# Altium schematic sheet Power.SchDoc
size A4; SheetNumber: 2; SheetTotal: 8
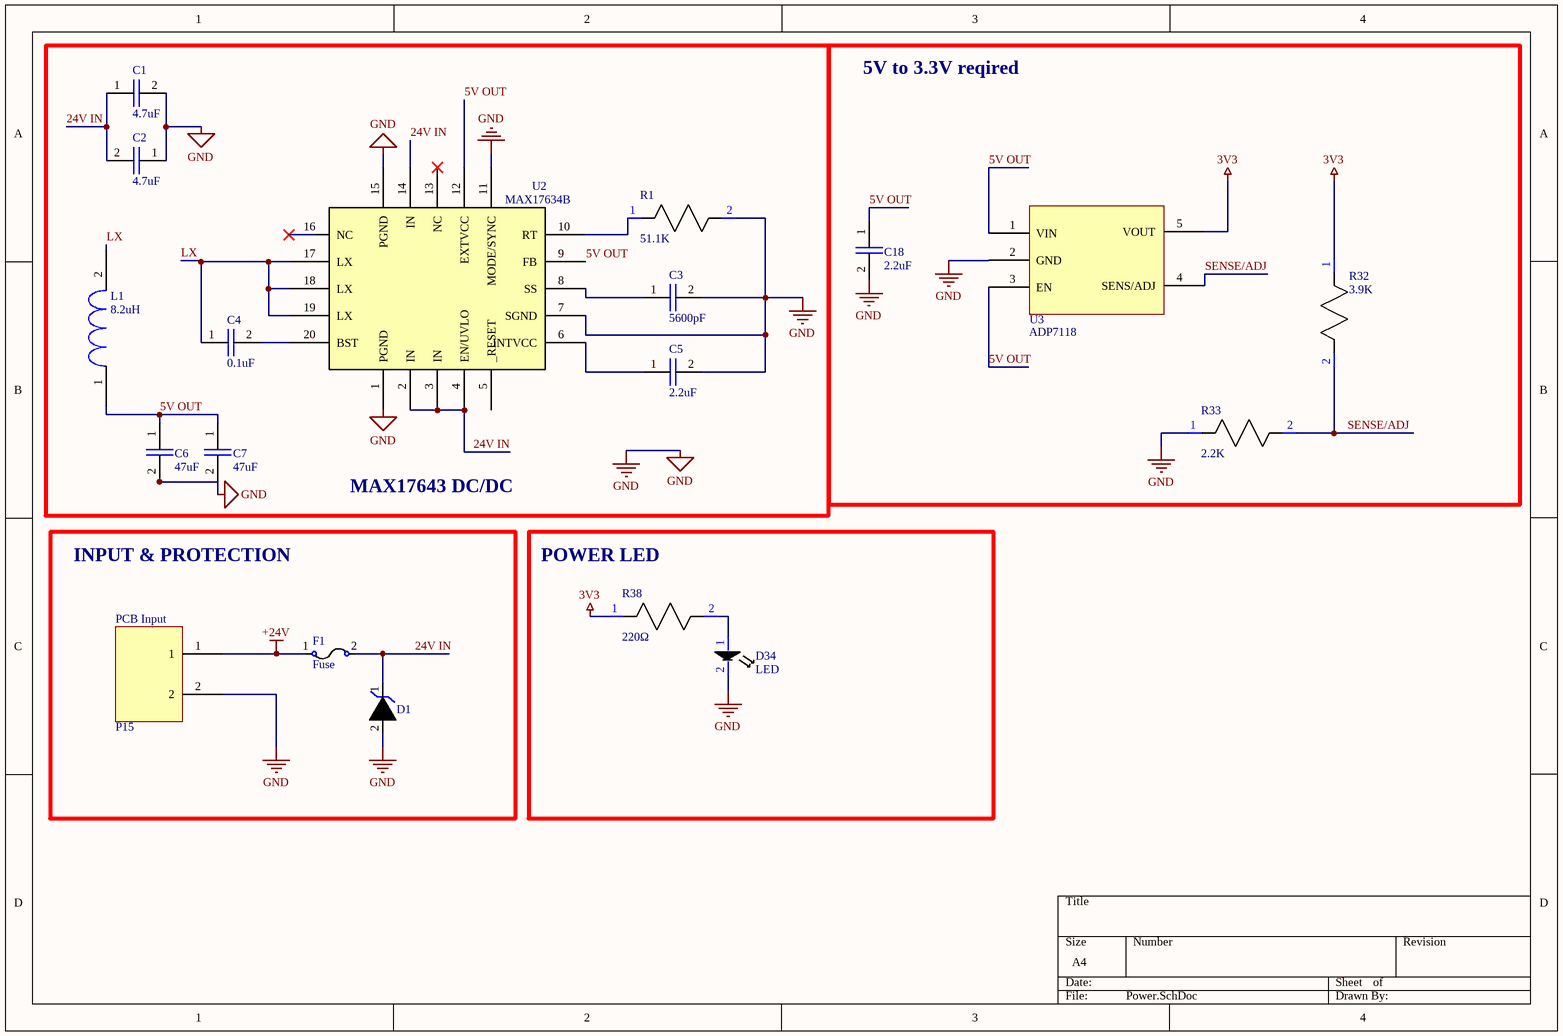
[diagram p0: Power.SchDoc]

## Parts
C1  value 4.7uF  [0603 Cap]  (hidden comment: 0603 Capacitor)
C2  value 4.7uF  [0603 Cap]  (hidden comment: 0603 Capacitor)
C3  value 5600pF  [0603 Cap]  (hidden comment: 0603 Capacitor)
C4  value 0.1uF  [0603 Cap]  (hidden comment: 0603 Capacitor)
C5  value 2.2uF  [0603 Cap]  (hidden comment: 0603 Capacitor)
C6  value 47uF  [0603 Cap]  (hidden comment: 0603 Capacitor)
C7  value 47uF  [0603 Cap]  (hidden comment: 0603 Capacitor)
C18  value 2.2uF  [0603 Cap]  (hidden comment: 0603 Capacitor)
D1  TVS  [TVS DIODE]  (value not drawn)
D34  LED  [0805 LED]
F1  Fuse  [0805 Fuse]
L1  8.2uH  [XAL6060]
P15  PCB Input  [WR-TBL 322 2H]
R1  value 51.1K  [0603 RES]  (hidden comment: Resistor)
R32  value 3.9K  [0603 RES]  (hidden comment: Resistor)
R33  value 2.2K  [0603 RES]  (hidden comment: Resistor)
R38  value 220Ω  [0603 RES]  (hidden comment: Resistor)
U2  MAX17634B  [20-PIN TQFN]
U3  ADP7118  [5-PIN TSOT]

## Blocks framed on the sheet
MAX17643 DC/DC: C1-C7 L1 R1 U2
5V to 3.3V reqired: C18 R32 R33 U3
INPUT & PROTECTION: D1 F1 P15
POWER LED: D34 R38

## Nets
3V3: R32.1 R38.1 U3.5(VOUT)
+24V: F1.1 P15.1
GND: C1.2 C2.1 C3.2 C5.2 C6.2 C7.2 C18.2 D1.2 D34.2 P15.2 R1.2 R33.1 U2.1(PGND) U2.7(SGND) U2.11(MODE/SYNC) U2.15(PGND) U3.2(GND)
5V OUT: C6.1 C7.1 C18.1 L1.1 U2.9(FB) U2.12(EXTVCC) U3.1(VIN) U3.3(EN)
24V IN: C1.1 C2.2 D1.1 F1.2 U2.2(IN) U2.3(IN) U2.4(EN/UVLO) U2.14(IN)
LX: C4.1 L1.2 U2.17(LX) U2.18(LX) U2.19(LX)
SENSE/ADJ: R32.2 R33.2 U3.4(SENS/ADJ)
NetC3_1: C3.1 U2.8(SS)
NetC4_2: C4.2 U2.20(BST)
NetC5_1: C5.1 U2.6(INTVCC)
NetD34_1: D34.1 R38.2
NetR1_1: R1.1 U2.10(RT)

Not connected (* = marked no-connect by the designer): U2 5(_RESET) 13(NC)* 16(NC)*

## Library data of the parts
C1-C7 C18 = 0603 Cap: SMD 0603 (ceramic) capacitor; Manufacturer: Murata; Manufacturer Part Number: GRM21BR71C225KA12L; Multilayer: Yes; Tolerance  (fill in as +-): 10%; Rated DC Voltage (URdc): 16V; Temperature Characteristics Code: X7R; Supplier: Mouser; Supplier Part Number: 81-GRM21BR71C225KA2L; RoHS: Yes; Category: Ceramic Capacitors; Stock: 30148; Pricing: 1=0,3, 10=0,163, 50=0,163, 100=0,098, 1000=0,07, 10000=0,054 (USD); Mounting Technology: Surface Mount; Pins: 2; Package Shape: Rectangular; Terminal Finish: Nickel; Dielectric Material: Ceramic; Case/Package: 0805; Min Operating Temperature: -55°C; Max Operating Temperature: 125°C; JESD-609 Code: e3; Package Style: SMTMeter; Capacitor Type: Ceramic; Packaging: Tape and Reel; Tolerance (fill in as +-): 10%; Termination: Wraparound; Length: 2mm; Width: 1.25mm; Height: 1.25mm; Reach SVHC Compliant: Yes; RoHS Compliant: Yes; ComponentLink1URL: https://datasheet.ciiva.com:443/pdfs/VipMasterIC/IC/MURE/MURE-S-A0004349797/MURE-S-A0004361718-1.pdf?src-supplier=IHS+Markit; ComponentLink1Description: https://datasheet.ciiva.com:443/pdfs/VipMasterIC/IC/MURE/MURE-S-A0004349797/MURE-S-A0004361718-1.pdf?src-supplier=IHS+Markit; ComponentLink2URL: https://datasheet.ciiva.com/7937/608985-7937701.pdf?src-supplier=Element14; ComponentLink2Description: https://datasheet.ciiva.com/7937/608985-7937701.pdf?src-supplier=Element14
D1 = TVS Diode: Schematic for TVS diode
F1 = Fuse: 0805 Fuse
L1 = Power Inductor: XAL6060 preferred
P15 = 322-2H: 322 series 2 pin header
R1 R32 R33 R38 = 0603 Res: Can be used for SMD resistors
U2 = 20-PIN TQFN: 20-PIN TSOT
U3 = 5-PIN TSOT: Schematic for all 5 pin TSOT